# Altium project HW_PROCESSOR_BOARD_R1.PrjPcb (part 2 of 2)

## Sheet 05_BUFFERS.SchDoc: =TitleParameter
size A3; DrawnBy: UKAYACIK; Organization: ASISGUARD; Address1: Kemalpasa, Kemalpasa Cd. No:290 D:292H, 35060 Bornova/Izmir/Turkey; Revision: R1M1
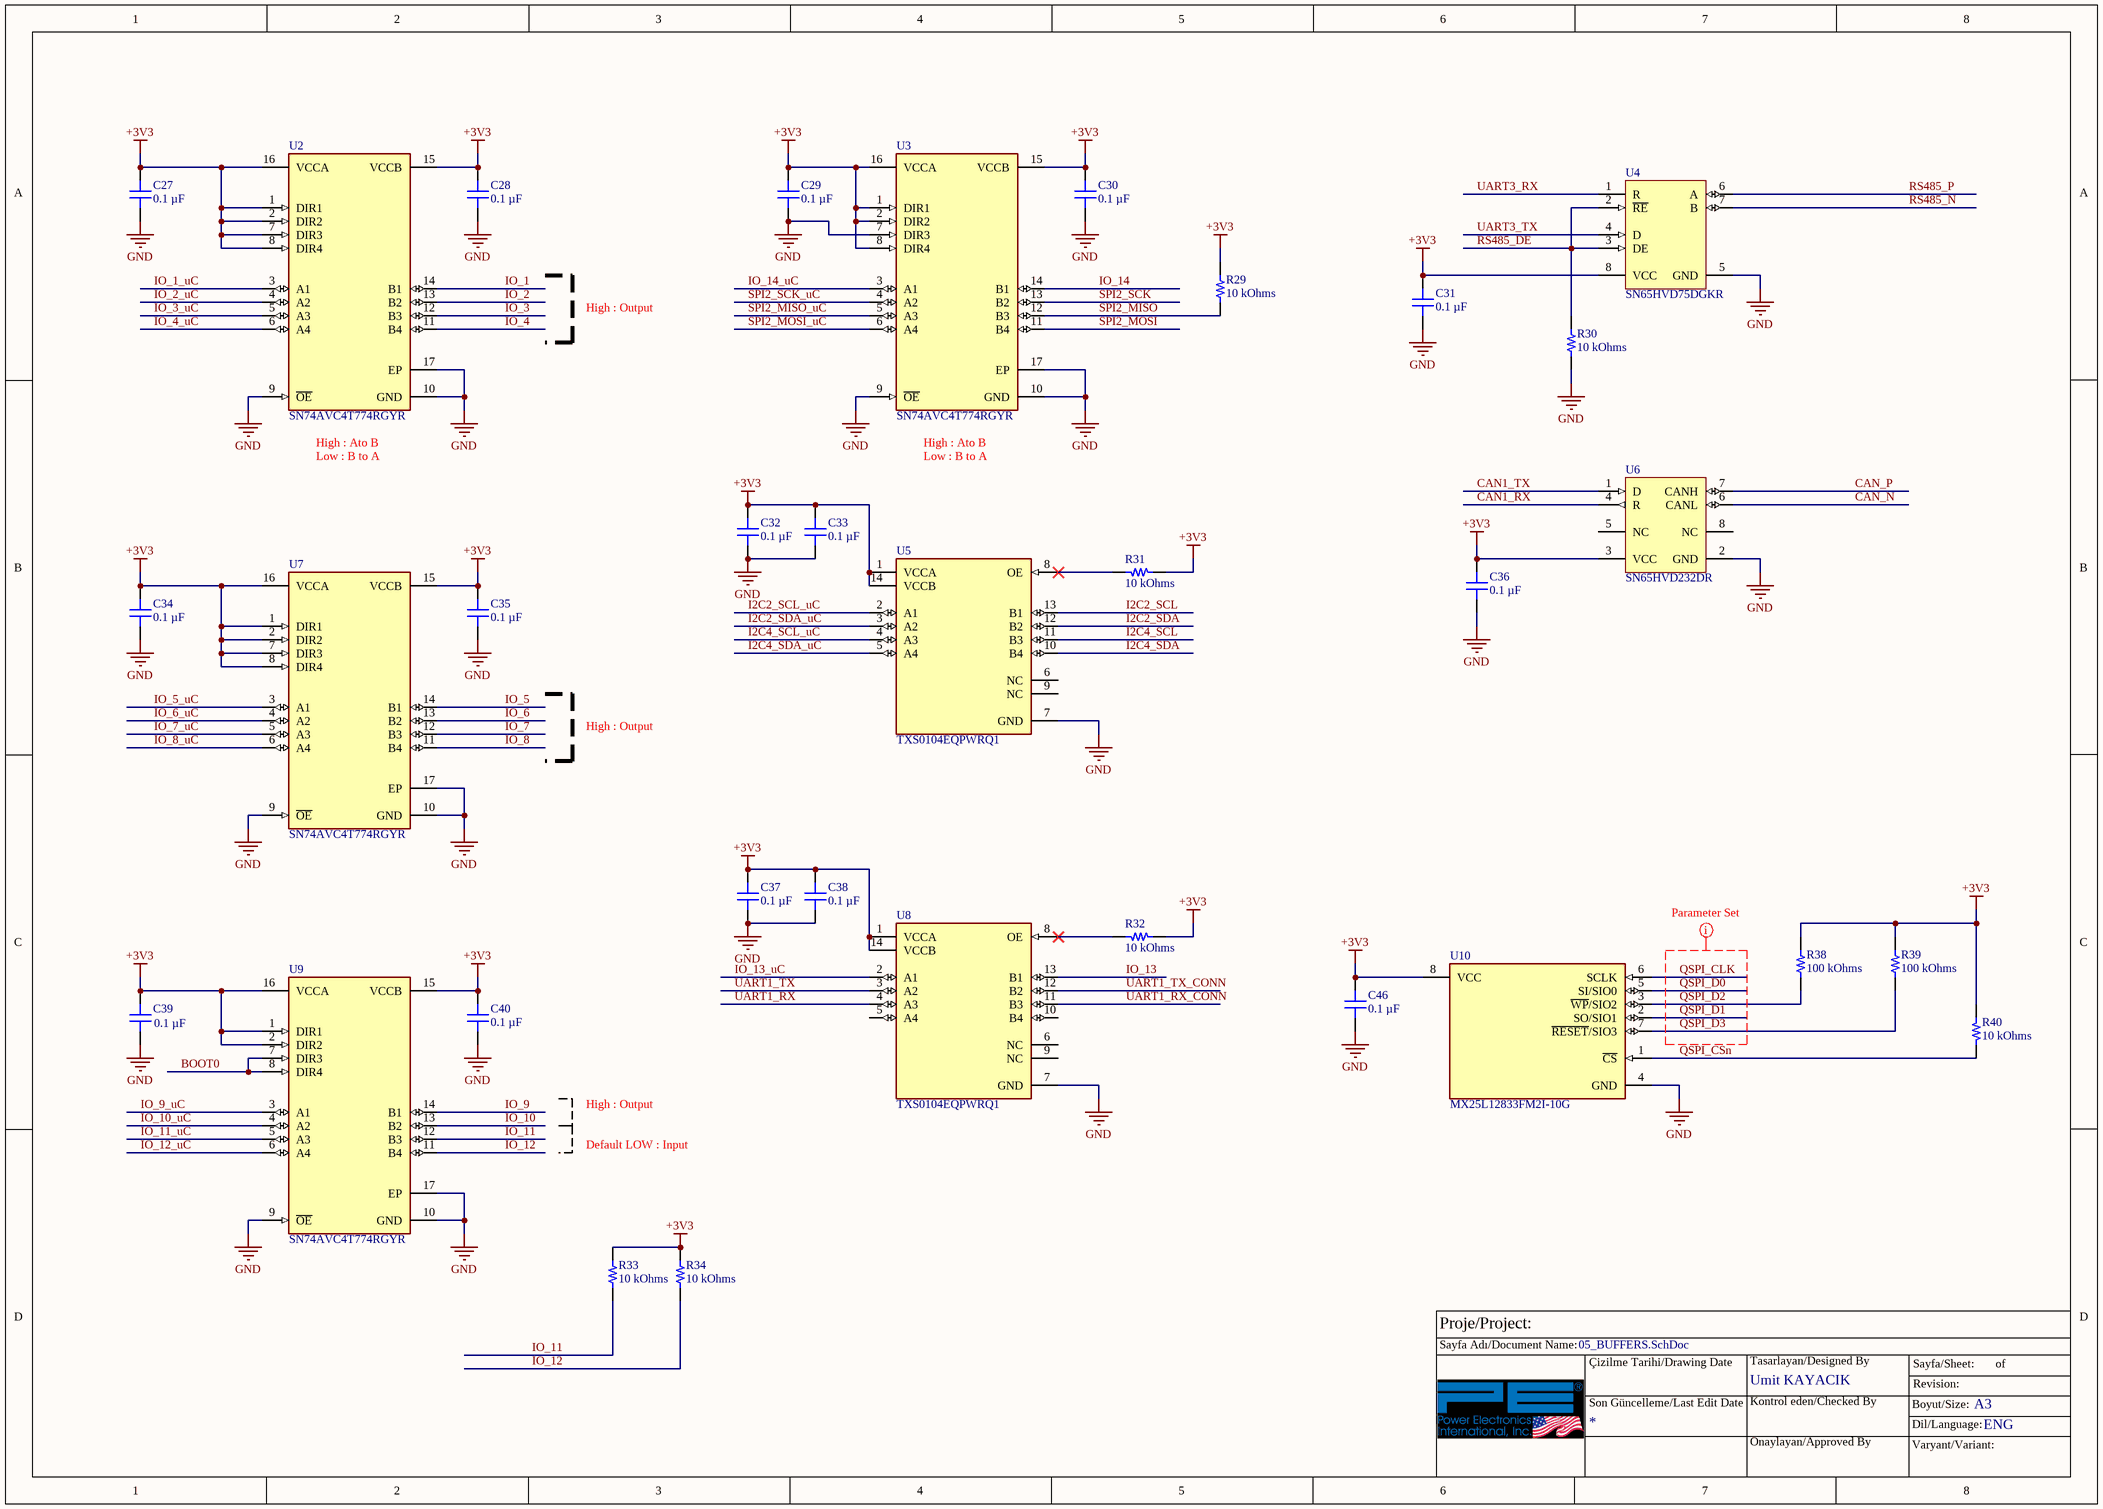
[diagram p5: 05_BUFFERS.SchDoc]

### Parts
C27  0.1 µF  [MURATA GRM155 0402_1005]
C28  0.1 µF  [MURATA GRM155 0402_1005]
C29  0.1 µF  [MURATA GRM155 0402_1005]
C30  0.1 µF  [MURATA GRM155 0402_1005]
C31  0.1 µF  [MURATA GRM155 0402_1005]
C32  0.1 µF  [MURATA GRM155 0402_1005]
C33  0.1 µF  [MURATA GRM155 0402_1005]
C34  0.1 µF  [MURATA GRM155 0402_1005]
C35  0.1 µF  [MURATA GRM155 0402_1005]
C36  0.1 µF  [MURATA GRM155 0402_1005]
C37  0.1 µF  [MURATA GRM155 0402_1005]
C38  0.1 µF  [MURATA GRM155 0402_1005]
C39  0.1 µF  [MURATA GRM155 0402_1005]
C40  0.1 µF  [MURATA GRM155 0402_1005]
C46  0.1 µF  [MURATA GRM155 0402_1005]
R29  10 kOhms  [RES 0402_1005]
R30  10 kOhms  [RES 0402_1005]
R31  10 kOhms  [RES 0402_1005]
R32  10 kOhms  [RES 0402_1005]
R33  10 kOhms  [RES 0402_1005]
R34  10 kOhms  [RES 0402_1005]
R38  100 kOhms  [YAGEO RES 0402_1005]
R39  100 kOhms  [YAGEO RES 0402_1005]
R40  10 kOhms  [RES 0402_1005]
U2  SN74AVC4T774RGYR  [FP-RGY0016A-MFG]
U3  SN74AVC4T774RGYR  [FP-RGY0016A-MFG]
U4  SN65HVD75DGKR  [DGK0008A_M]
U5  TXS0104EQPWRQ1  [FP-PW0014A-IPC_C]
U6  SN65HVD232DR  [D0008A_M]
U7  SN74AVC4T774RGYR  [FP-RGY0016A-MFG]
U8  TXS0104EQPWRQ1  [FP-PW0014A-IPC_C]
U9  SN74AVC4T774RGYR  [FP-RGY0016A-MFG]
U10  MX25L12833FM2I-10G  [FP-MX25L12833FM2I-10G-MFG]

### Nets
+3V3: C27.2 C28.2 C29.2 C30.2 C31.2 C32.2 C33.2 C34.2 C35.2 C36.2 C37.2 C38.2 C39.2 C40.2 C46.2 R29.2 R31.1 R32.1 R33.2 R34.2 R38.2 R39.2 R40.1 U2.1(DIR1) U2.2(DIR2) U2.7(DIR3) U2.8(DIR4) U2.15(VCCB) U2.16(VCCA) U3.1(DIR1) U3.2(DIR2) U3.8(DIR4) U3.15(VCCB) U3.16(VCCA) U4.8(VCC) U5.1(VCCA) U5.14(VCCB) U6.3(VCC) U7.1(DIR1) U7.2(DIR2) U7.7(DIR3) U7.8(DIR4) U7.15(VCCB) U7.16(VCCA) U8.1(VCCA) U8.14(VCCB) U9.1(DIR1) U9.2(DIR2) U9.15(VCCB) U9.16(VCCA) U10.8(VCC)
GND: C27.1 C28.1 C29.1 C30.1 C31.1 C32.1 C33.1 C34.1 C35.1 C36.1 C37.1 C38.1 C39.1 C40.1 C46.1 R30.1 U2.9(~{OE}) U2.10(GND) U2.17(EP) U3.7(DIR3) U3.9(~{OE}) U3.10(GND) U3.17(EP) U4.5(GND) U5.7(GND) U6.2(GND) U7.9(~{OE}) U7.10(GND) U7.17(EP) U8.7(GND) U9.9(~{OE}) U9.10(GND) U9.17(EP) U10.4(GND)
BOOT0: U9.7(DIR3) U9.8(DIR4)
CAN1_RX: U6.4(R)
CAN1_TX: U6.1(D)
CAN_N: U6.6(CANL)
CAN_P: U6.7(CANH)
I2C2_SCL: U5.13(B1)
I2C2_SCL_uC: U5.2(A1)
I2C2_SDA: U5.12(B2)
I2C2_SDA_uC: U5.3(A2)
I2C4_SCL: U5.11(B3)
I2C4_SCL_uC: U5.4(A3)
I2C4_SDA: U5.10(B4)
I2C4_SDA_uC: U5.5(A4)
IO_1: U2.14(B1)
IO_1_uC: U2.3(A1)
IO_2: U2.13(B2)
IO_2_uC: U2.4(A2)
IO_3: U2.12(B3)
IO_3_uC: U2.5(A3)
IO_4: U2.11(B4)
IO_4_uC: U2.6(A4)
IO_5: U7.14(B1)
IO_5_uC: U7.3(A1)
IO_6: U7.13(B2)
IO_6_uC: U7.4(A2)
IO_7: U7.12(B3)
IO_7_uC: U7.5(A3)
IO_8: U7.11(B4)
IO_8_uC: U7.6(A4)
IO_9: U9.14(B1)
IO_9_uC: U9.3(A1)
IO_10: U9.13(B2)
IO_10_uC: U9.4(A2)
IO_11: R33.1 U9.12(B3)
IO_11_uC: U9.5(A3)
IO_12: R34.1 U9.11(B4)
IO_12_uC: U9.6(A4)
IO_13: U8.13(B1)
IO_13_uC: U8.2(A1)
IO_14: U3.14(B1)
IO_14_uC: U3.3(A1)
QSPI_CLK: U10.6(SCLK)
QSPI_CSn: R40.2 U10.1(~{CS})
QSPI_D0: U10.5(SI/SIO0)
QSPI_D1: U10.2(SO/SIO1)
QSPI_D2: R38.1 U10.3(~{WP}/SIO2)
QSPI_D3: R39.1 U10.7(~{RESET}/SIO3)
RS485_DE: R30.2 U4.2(~{RE}) U4.3(DE)
RS485_N: U4.7(B)
RS485_P: U4.6(A)
SPI2_MISO: R29.1 U3.12(B3)
SPI2_MISO_uC: U3.5(A3)
SPI2_MOSI: U3.11(B4)
SPI2_MOSI_uC: U3.6(A4)
SPI2_SCK: U3.13(B2)
SPI2_SCK_uC: U3.4(A2)
UART1_RX: U8.4(A3)
UART1_RX_CONN: U8.11(B3)
UART1_TX: U8.3(A2)
UART1_TX_CONN: U8.12(B2)
UART3_RX: U4.1(R)
UART3_TX: U4.4(D)
NetR31_2: R31.2 U5.8(OE)
NetR32_2: R32.2 U8.8(OE)

Not connected (* = marked no-connect by the designer): U5 6(NC) 9(NC); U6 5(NC) 8(NC); U8 5(A4) 6(NC) 9(NC) 10(B4)

### Layout directives
net class QSPI: QSPI_CLK, QSPI_D0, QSPI_D1, QSPI_D2, QSPI_D3

### Notes on the sheet
- High : Output
- (near U2) High : Ato B
- (near U3) High : Ato B
- Low : B to A
- Default LOW : Input
- Proje/Project:
- Sayfa Adı/Document Name:
- Çizilme Tarihi/Drawing Date
- Umit KAYACIK
- Tasarlayan/Designed By
- Sayfa/Sheet:
- Revision:
- of
- Son Güncelleme/Last Edit Date
- Kontrol eden/Checked By
- Onaylayan/Approved By
- Boyut/Size:
- Varyant/Variant:
- Dil/Language:
- A3
- ENG

### Library data of the parts
C27-C40 C46 = GRM155R71H104KE14J: CAP CER 0.1UF 50V X7R 0402; manufacturer: Murata Electronics; Tolerance: ±10%; Part Number: GRM155R71H104KE14J; Capacitance: 0.1 µF; Applications: General Purpose; componentlink1description: Datasheet; componentlink1url: https://search.murata.co.jp/Ceramy/image/img/A01X/G101/ENG/GRM155R71H104KE14-01.pdf; componentlink2description: DigiKey Link; componentlink2url: https://www.digikey.com/en/products/detail/murata-electronics/GRM155R71H104KE14J/4905180; Device Package: 0402 (1005 Metric); lastupdated: 7/23/2025 10:42:35 AM; Lifecycle Status: Active; Minimum Order: 1; Mounting Type: Surface Mount, MLCC; Operating Temperature: -55°C ~ 125°C; Package / Case: 0402 (1005 Metric); packaging: CutTape; partid: 4071; Part Status: Active; price: 0.01; series: GRM; Size / Dimension: 0.039" L x 0.020" W (1.00mm x 0.50mm); Supplier 1: DigiKey; Supplier Part Number 1: 490-13342-1-ND; Temperature Coefficient: X7R; Thickness (Max): 0.022" (0.55mm); value: 0.1 µF; Voltage - Rated: 50V
R29-R34 R40 = RC0402FR-0710KL: RES 10K OHM 1% 1/16W 0402; Manufacturer: Yageo; Power (Watts): 0.063W, 1/16W; Temperature Coefficient: ±100ppm/°C; Part Number: RC0402FR-0710KL; Value: 10 kOhms; ComponentLink1Description: Datasheet; ComponentLink1URL: https://www.yageo.com/upload/media/product/productsearch/datasheet/rchip/PYu-RC_Group_51_RoHS_L_10.pdf; ComponentLink2Description: DigiKey Link; ComponentLink2URL: https://www.digikey.com/en/products/detail/yageo/RC0402FR-0710KL/726523; Composition: Thick Film; Device Package: 0402 (1005 Metric); Features: Moisture Resistant; Height - Seated (Max): 0.016" (0.40mm); LastUpdated: 30.04.2023 19:24:29; Lifecycle Status: Active; Minimum Order: 1; Number of Terminations: 2; Operating Temperature: -55°C ~ 155°C; Package / Case: 0402 (1005 Metric); Packaging: CutTape; PartId: 17593; Part Status: Active; Price: 0.01; Resistance: 10 kOhms; Series: RC_L; Size / Dimension: 0.039" L x 0.020" W (1.00mm x 0.50mm); Supplier 1: DigiKey; Supplier Part Number 1: 311-10.0KLRCT-ND; Supplier Device Package: 0402; Tolerance: ±1%
R38 R39 = RC0402FR-07100KL: RES 100K OHM 1% 1/16W 0402; Manufacturer: Yageo; Power (Watts): 0.063W, 1/16W; Temperature Coefficient: ±100ppm/°C; Part Number: RC0402FR-07100KL; Value: 100 kOhms; ComponentLink1Description: Datasheet; ComponentLink1URL: https://www.yageo.com/upload/media/product/productsearch/datasheet/rchip/PYu-RC_Group_51_RoHS_L_10.pdf; ComponentLink2Description: DigiKey Link; ComponentLink2URL: https://www.digikey.com/en/products/detail/yageo/RC0402FR-07100KL/726526; Composition: Thick Film; Device Package: 0402 (1005 Metric); Features: Moisture Resistant; Height - Seated (Max): 0.016" (0.40mm); LastUpdated: 8/31/2025 3:04:04 PM; Lifecycle Status: Active; Minimum Order: 1; Number of Terminations: 2; Operating Temperature: -55°C ~ 155°C; Package / Case: 0402 (1005 Metric); Packaging: CutTape; PartId: 17595; Part Status: Active; Price: 0.01; Resistance: 100 kOhms; Series: RC_L; Size / Dimension: 0.039" L x 0.020" W (1.00mm x 0.50mm); Supplier 1: DigiKey; Supplier Part Number 1: 311-100KLRCT-ND; Supplier Device Package: 0402; Tolerance: ±1%
U2 U3 U7 U9 = CMP-04899-000023-1: IC TRNSLTR BIDIRECTIONAL 16VQFN; Manufacturer: Texas Instruments; V A Max: 3.6V; Number Of Inputs: 4; Min Supply Voltage: 1.2V; Nominal Supply Current: 16uA; Data Rate: 380Mbits/s; Propagation Delay: 2.6ns; Number Of Circuits: 1; Standoff Height: 0mm; Logic Function Desc: Non-Inverting; Temperature: -40°C to +85°C; Max Supply Voltage: 3.6V; Temperature Range High: +85°C; Octopart: https://octopart.com/sn74avc4t774rgyr-texas+instruments-12195083; Device Class L1: Integrated Circuits (ICs); Ambient Temperature Range Low: -40°C; ComponentLink2Description: Datasheet; Ambient Temperature Range High: +85°C; V A Min: 1.2V; Number Of Outputs: 4; Manufacturer Part Number: SN74AVC4T774RGYR; Ipc Land Pattern Name: QFN50P350X400X90-16; Digikey Description: IC TRNSLTR BIDIRECTIONAL 16VQFN; Device Class L3: Voltage Level Shifters; Device Class L2: Logic ICs; Lead Free: Yes; Package: RGY0016A; ComponentLink2URL: http://www.ti.com/lit/ds/symlink/sn74avc4t774.pdf; Height: 1mm; V B Min: 1.2V; RoHS: TRUE; V B Max: 3.6V; Temperature Range Low: -40°C; Mouser Description: Translation - Voltage Levels 4B Dual-Supply Bus Xcvr; Category: IC; Automotive: No
U4 = CMP-0694-00009-2: 3.3 V Supply RS-485 with IEC ESD Protection, 20 Mbps, -40 to 125 degC, 8-Pin VSSOP, RoHS, Tape and Reel; Manufacturer: Texas Instruments; No. of TX: 1; ICC (Max) (mA): 0.95; Signaling Rate (Max) (Mbps): 20; VI: -7 to 12 V; VCC: 3 to 3.6 V; ESD: 15 kV; PackageVersion: 4073329/E; PackageDescription: 8-Pin Plastic Small-Outline Package, Body 3 x 3 mm, Pitch 0.65 mm; Packing: Tape and Reel; Mounting Technology: Surface Mount; ComponentLink1Description: Manufacturer URL; PackageReference: DGK0008A; ComponentLink2URL: http://www.ti.com/lit/ds/sllse11c/sllse11c.pdf; DatasheetVersion: SLLSE11C; ComponentLink3Description: Package Specification; PartNumber: SN65HVD75DGKR; ComponentLink2Description: Datasheet; ComponentLink1URL: http://www.ti.com/; No. of RX: 1; ComponentLink3URL: http://www.ti.com/lit/ds/sllse11c/sllse11c.pdf; Operating Temperature Range: -40 to 125 degC; RoHS: TRUE
U5 U8 = CMP-04899-000064-1: IC TRNSLTR BIDIRECTIONAL 14TSSOP; Min Supply Voltage: 1.65V; Quiescent Current: 14.4uA; Data Rate: 24Mbps; Logic Function: Translator; Number of Circuits: 1; Number of Bits: 4; Low Level Output Current: 1mA; Max Supply Voltage: 5.5V; High Level Output Current: -20uA; Operating Supply Current: 25uA; Propagation Delay: 4.6ns; Contact Plating: Gold; Package Quantity: 2000; Number of Pins: 14; Lead Free: Lead Free; Weight: 0.004949oz; Min Operating Temperature: -40°C; Number of Channels: 4; Packaging: Tape and Reel; Mount: Surface Mount; Max Operating Temperature: 125°C; Case/Package: TSSOP; Channel Type: Bidirectional; RoHS Compliant: Yes; Radiation Hardening: No
U6 = CMP-0315-00075-2: 3.3 V Can Transceiver, 17 mA, -40 to 85 degC, 8-pin SOIC (D), Green (RoHS & no Sb/Br); Manufacturer: Texas Instruments; Supply Voltage(s)(V): 3.3; Receivers Per Package: 1; ICC(Max)(mA): 17; Rating: Catalog; Transient Pulse Protection(V): -25 to 25; Mounting Technology: Surface Mount; PartNumber: SN65HVD232DR; Code_JEDEC: MS-012AA; Eco-Plan: Green (RoHS & no Sb/Br); Isolated: No; SubFamily: CAN; Footprint: SN65HVD232; Drivers Per Package: 1; ComponentLink1URL: http://www.ti.com/general/docs/lit/getliterature.tsp?genericPartNumber=SN65HVD232&fileType=pdf; ComponentLink1Description: Datasheet; PackageDescription: 8-Pin Plastic Small Outline Integrated Circuit, 4.9 x 3.9 mm, Pitch 1.27 mm Pitch; PackageReference: D0008A; DatasheetVersion: SLOS346K; PackageVersion: revM, Jun-2011
U10 = CMP-105207-000006-1: IC FLASH 128MBIT SPI/QUAD 8SOP; RoHS Compliant: Yes

## Nets that join several sheets
+3V3: 03_CONNECTOR (9 pins), 04_MCU (20 pins), 05_BUFFERS (51 pins)
GND: 03_CONNECTOR (68 pins), 04_MCU (48 pins), 05_BUFFERS (34 pins)
ADC_IN_1: 03_CONNECTOR (J1.21), 04_MCU (D14.2 R13.1)
ADC_IN_2: 03_CONNECTOR (J1.23), 04_MCU (D15.2 R15.1)
ADC_IN_3: 03_CONNECTOR (J1.25), 04_MCU (D16.2 R17.1)
ADC_IN_4: 03_CONNECTOR (J1.27), 04_MCU (D17.2 R19.1)
ADC_IN_5: 03_CONNECTOR (J1.29), 04_MCU (D18.2 R21.1)
ADC_IN_6: 03_CONNECTOR (J1.31), 04_MCU (D19.2 R23.1)
ADC_IN_7: 03_CONNECTOR (J1.33), 04_MCU (D20.2 R25.1)
ADC_IN_8: 03_CONNECTOR (J1.35), 04_MCU (D21.2 R27.1)
ADC_REF_IN: 03_CONNECTOR (J1.37), 04_MCU (D12.2 R3.1)
BOOT0: 04_MCU (R5.2 R6.1 U99.95), 05_BUFFERS (U9.7 U9.8)
CAN1_RX: 04_MCU (U99.82), 05_BUFFERS (U6.4)
CAN1_TX: 04_MCU (U99.83), 05_BUFFERS (U6.1)
CAN_N: 03_CONNECTOR (J4.2 R1.2), 05_BUFFERS (U6.6)
CAN_P: 03_CONNECTOR (J4.1 R1.1), 05_BUFFERS (U6.7)
CENTER: 03_CONNECTOR (D4.2 J2.3), 04_MCU (U99.31)
DOWN: 03_CONNECTOR (D2.2 J2.5), 04_MCU (U99.32)
I2C2_SCL: 03_CONNECTOR (J1.55), 05_BUFFERS (U5.13)
I2C2_SCL_uC: 04_MCU (U99.70), 05_BUFFERS (U5.2)
I2C2_SDA: 03_CONNECTOR (J1.53), 05_BUFFERS (U5.12)
I2C2_SDA_uC: 04_MCU (U99.69), 05_BUFFERS (U5.3)
I2C4_SCL: 03_CONNECTOR (J1.57), 05_BUFFERS (U5.11)
I2C4_SCL_uC: 04_MCU (U99.65), 05_BUFFERS (U5.4)
I2C4_SDA: 03_CONNECTOR (J1.59), 05_BUFFERS (U5.10)
I2C4_SDA_uC: 04_MCU (U99.66), 05_BUFFERS (U5.5)
IO_1: 03_CONNECTOR (J1.01), 05_BUFFERS (U2.14)
IO_1_uC: 04_MCU (U99.97), 05_BUFFERS (U2.3)
IO_2: 03_CONNECTOR (J1.03), 05_BUFFERS (U2.13)
IO_2_uC: 04_MCU (U99.98), 05_BUFFERS (U2.4)
IO_3: 03_CONNECTOR (J1.05), 05_BUFFERS (U2.12)
IO_3_uC: 04_MCU (U99.1), 05_BUFFERS (U2.5)
IO_4: 03_CONNECTOR (J1.07), 05_BUFFERS (U2.11)
IO_4_uC: 04_MCU (U99.2), 05_BUFFERS (U2.6)
IO_5: 03_CONNECTOR (J1.09), 05_BUFFERS (U7.14)
IO_5_uC: 04_MCU (U99.3), 05_BUFFERS (U7.3)
IO_6: 03_CONNECTOR (J1.11), 05_BUFFERS (U7.13)
IO_6_uC: 04_MCU (U99.4), 05_BUFFERS (U7.4)
IO_7: 03_CONNECTOR (J1.13), 05_BUFFERS (U7.12)
IO_7_uC: 04_MCU (U99.5), 05_BUFFERS (U7.5)
IO_8: 03_CONNECTOR (J1.15), 05_BUFFERS (U7.11)
IO_8_uC: 04_MCU (U99.10), 05_BUFFERS (U7.6)
IO_9: 03_CONNECTOR (J1.17), 05_BUFFERS (U9.14)
IO_9_uC: 04_MCU (U99.42), 05_BUFFERS (U9.3)
IO_10: 03_CONNECTOR (J1.19), 05_BUFFERS (U9.13)
IO_10_uC: 04_MCU (U99.39), 05_BUFFERS (U9.4)
IO_11: 03_CONNECTOR (J1.39), 05_BUFFERS (R33.1 U9.12)
IO_11_uC: 04_MCU (U99.41), 05_BUFFERS (U9.5)
IO_12: 03_CONNECTOR (J1.41), 05_BUFFERS (R34.1 U9.11)
IO_12_uC: 04_MCU (U99.40), 05_BUFFERS (U9.6)
IO_13: 03_CONNECTOR (J1.43), 05_BUFFERS (U8.13)
IO_13_uC: 04_MCU (U99.43), 05_BUFFERS (U8.2)
IO_14: 03_CONNECTOR (J1.45), 05_BUFFERS (U3.14)
IO_14_uC: 04_MCU (U99.51), 05_BUFFERS (U3.3)
LCD_BL: 03_CONNECTOR (D11.2 J3.8), 04_MCU (R11.1 U99.91)
LCD_CSn: 03_CONNECTOR (D8.2 J3.5), 04_MCU (R8.2 U99.89)
LCD_DC: 03_CONNECTOR (D9.2 J3.6), 04_MCU (R9.2 U99.88)
LCD_MOSI: 03_CONNECTOR (D6.2 J3.3), 04_MCU (U99.92)
LCD_RSTn: 03_CONNECTOR (D10.2 J3.7), 04_MCU (R10.2 U99.87)
LCD_SCLK: 03_CONNECTOR (D7.2 J3.4), 04_MCU (U99.90)
LEFT: 03_CONNECTOR (D3.2 J2.4), 04_MCU (U99.38)
QSPI_CLK: 04_MCU (U99.11), 05_BUFFERS (U10.6)
QSPI_CSn: 04_MCU (U99.85), 05_BUFFERS (R40.2 U10.1)
QSPI_D0: 04_MCU (U99.16), 05_BUFFERS (U10.5)
QSPI_D1: 04_MCU (U99.17), 05_BUFFERS (U10.2)
QSPI_D2: 04_MCU (U99.18), 05_BUFFERS (R38.1 U10.3)
QSPI_D3: 04_MCU (U99.30), 05_BUFFERS (R39.1 U10.7)
RIGHT: 03_CONNECTOR (D1.2 J2.6), 04_MCU (U99.34)
RS485_DE: 04_MCU (U99.67), 05_BUFFERS (R30.2 U4.2 U4.3)
RS485_N: 03_CONNECTOR (J5.2 R2.2), 05_BUFFERS (U4.7)
RS485_P: 03_CONNECTOR (J5.1 R2.1), 05_BUFFERS (U4.6)
SPI2_MISO: 03_CONNECTOR (J1.49), 05_BUFFERS (R29.1 U3.12)
SPI2_MISO_uC: 04_MCU (U99.53), 05_BUFFERS (U3.5)
SPI2_MOSI: 03_CONNECTOR (J1.51), 05_BUFFERS (U3.11)
SPI2_MOSI_uC: 04_MCU (U99.54), 05_BUFFERS (U3.6)
SPI2_SCK: 03_CONNECTOR (J1.47), 05_BUFFERS (U3.13)
SPI2_SCK_uC: 04_MCU (U99.52), 05_BUFFERS (U3.4)
TAMPER_IO: 03_CONNECTOR (J1.04), 04_MCU (R7.1 U99.7)
UART1_RX: 04_MCU (U99.94), 05_BUFFERS (U8.4)
UART1_RX_CONN: 03_CONNECTOR (J8.2), 05_BUFFERS (U8.11)
UART1_TX: 04_MCU (U99.93), 05_BUFFERS (U8.3)
UART1_TX_CONN: 03_CONNECTOR (J8.1), 05_BUFFERS (U8.12)
UART3_RX: 04_MCU (U99.50), 05_BUFFERS (U4.1)
UART3_TX: 04_MCU (U99.47), 05_BUFFERS (U4.4)
UP: 03_CONNECTOR (D5.2 J2.2), 04_MCU (U99.33)
USB_N: 03_CONNECTOR (D24.2 J7.A7 J7.B7), 04_MCU (U99.72)
USB_P: 03_CONNECTOR (D23.2 J7.A6 J7.B6), 04_MCU (U99.73)
VBUS_DETECT: 03_CONNECTOR (U1.4), 04_MCU (U99.71)

## Assembly variants
Variant of HW_PROCESSOR_BOARD_R1: not fitted R1 R2 R5